# Altium project Raven.PrjPcb
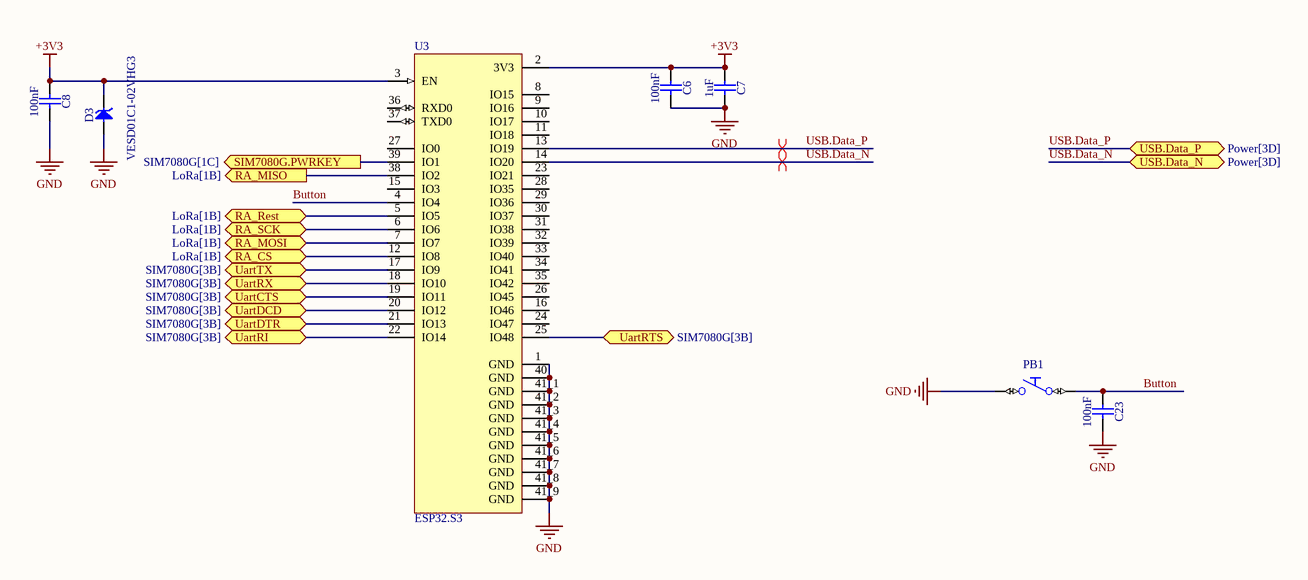
[diagram p0: MCU.SchDoc]
4 sheets, 68 parts. Net scope: flat (ports and power ports of the same name join across sheets).
Board file: PCB1.PcbDoc
Sheets:
  MCU.SchDoc
  Power.SchDoc
  SIM7080G.SchDoc
  LoRa.SchDoc

## Sheet MCU.SchDoc
size A4; SheetNumber: 1; SheetTotal: 4

### Parts
C6  100nF  [CAPC1608X90N]
C7  1uF  [CAPC1608X90N]
C8  100nF  [CAPC1608X90N]
C23  100nF  [CAPC1608X90N]
D3  VESD01C1-02VHG3  [SODFL1608X70N]
PB1  Push Button  [PB_C&K_KSS221GLFS]  (value not drawn)
U3  ESP32.S3  [IC.ESP32.S3.WROOM.1U]

### Ports
RA_CS (bidir, see LoRa[1B]), RA_MISO (out, see LoRa[1B]), RA_MOSI (bidir, see LoRa[1B]), RA_Rest (bidir, see LoRa[1B]), RA_SCK (bidir, see LoRa[1B]), SIM7080G.PWRKEY (out, see SIM7080G[1C]), UartCTS (bidir, see SIM7080G[3B]), UartDCD (bidir, see SIM7080G[3B]), UartDTR (bidir, see SIM7080G[3B]), UartRI (bidir, see SIM7080G[3B]), UartRTS (bidir, see SIM7080G[3B]), UartRX (bidir, see SIM7080G[3B]), UartTX (bidir, see SIM7080G[3B]), USB.Data_N (bidir, see Power[3D]), USB.Data_P (bidir, see Power[3D])

### Nets
+3V3: C6.1 C7.1 C8.1 D3.1(C) U3.2(3V3) U3.3(EN)
GND: C6.2 C7.2 C8.2 C23.2 D3.2(A) PB1.2(NO) U3.1(GND) U3.40(GND) U3.41_1(GND) U3.41_2(GND) U3.41_3(GND) U3.41_4(GND) U3.41_5(GND) U3.41_6(GND) U3.41_7(GND) U3.41_8(GND) U3.41_9(GND)
Button: C23.1 PB1.1(C) U3.4(IO4)
USB.Data_N: U3.14(IO20) ; port USB.Data_N
USB.Data_P: U3.13(IO19) ; port USB.Data_P
NetR22_1: U3.39(IO1) ; port SIM7080G.PWRKEY
NetU3_5: U3.5(IO5) ; port RA_Rest
NetU3_6: U3.6(IO6) ; port RA_SCK
NetU3_7: U3.7(IO7) ; port RA_MOSI
NetU3_12: U3.12(IO8) ; port RA_CS
NetU3_17: U3.17(IO9) ; port UartTX
NetU3_18: U3.18(IO10) ; port UartRX
NetU3_19: U3.19(IO11) ; port UartCTS
NetU3_20: U3.20(IO12) ; port UartDCD
NetU3_21: U3.21(IO13) ; port UartDTR
NetU3_22: U3.22(IO14) ; port UartRI
NetU3_25: U3.25(IO48) ; port UartRTS
NetU3_38: U3.38(IO2) ; port RA_MISO

Not connected (* = marked no-connect by the designer): U3 8(IO15) 9(IO16) 10(IO17) 11(IO18) 15(IO3) 16(IO46) 23(IO21) 24(IO47) 26(IO45) 27(IO0) 28(IO35) 29(IO36) 30(IO37) 31(IO38) 32(IO39) 33(IO40) 34(IO41) 35(IO42) 36(RXD0) 37(TXD0)

### Layout directives
differential pair: USB.Data_N, USB.Data_P

### Library data of the parts
C6 C8 C23 = CC0603_100NF_25V_20%_X5R_TDK_CGA3E2X5R1E104M080: Non-polarised capacitor; Part Description: SMD Multilayer Chip Ceramic Capacitor (Automotive Grade); Manufacturer: TDK; Voltage: 25V; TC: X5R; Tolerance: ±20%; Part Number: CC0603_100NF_25V_20%_X5R_TDK_CGA3E2X5R1E104M080; Component Kind: Standard; Component Type: Standard; Pin Count: 2; Value: 100nF; Status: Not Recommended; Manufacturer Part Number: CGA3E2X5R1E104M080; Case: 0603; Mounted: Yes; Socket: No; SMD: Yes; Sense: No; ComponentHeight: 0.9mm; HelpURL: \\cern.ch\dfs\Applications\Altium\Datasheets\CC0603_X5R_TDK_CGA(Up to 75V).pdf; Author: CERN DEM BC; CreateDate: 7/1/2020; LatestRevisionDate: 7/1/2020
C7 = CC0603_1UF_10V_10%_X5R: Non-polarised capacitor; Part Description: SMD Multilayer Chip Ceramic Capacitor; Manufacturer: GENERIC; Manufacturer1 Part Number: 0603ZD105KAT; Voltage: 10V; TC: X5R; Tolerance: ±10%; Part Number: CC0603_1UF_10V_10%_X5R; Component Kind: Standard; Component Type: Standard; Pin Count: 2; Value: 1uF; Status: None; Manufacturer Part Number: CC0603_1UF_10V_10%_X5R; Case: 0603; Mounted: Yes; Socket: No; SMD: Yes; Sense: No; Manufacturer1 Example: AVX; Manufacturer1 ComponentHeight: 0.9mm; HelpURL: \\cern.ch\dfs\Applications\Altium\Datasheets\CC0603_X5R_AVX_0603ZD105KAT.pdf; Author: CERN DEM HF; CreateDate: 7/10/2023; LatestRevisionDate: 7/10/2023
D3 = VESD01C1-02VHG3: Transient Voltage Suppressor Diode (Uni-Directional); Part Description: Single-Line ESD-Protection (30kV) Diode; Manufacturer: VISHAY SEMICONDUCTORS; Voltage: 1V; Power: 100W; PressFit: No; Bonding: No; Part Number: VESD01C1-02VHG3; Component Kind: Standard; Component Type: Standard; Device: VESD01C1-02VHG3; PackageDescription: SODFL (SOD-523) Diode; 1.20mm W X 0.80mm L X 0.70mm H body, IPC Medium Density; Manufacturer Part Number: VESD01C1-02VHG3; Pin Count: 2; Case: SOD-523; Mounted: Yes; Socket: No; SMD: Yes; Sense: No; ComponentHeight: 0.7mm; HelpURL: \\cern.ch\dfs\Applications\Altium\Datasheets\VESD01C1-02VHG3.pdf; Author: CERN DEM BC; CreateDate: 5/19/2020; LatestRevisionDate: 5/19/2020
PB1 = PB_C&K_KSS221GLFS: Push-Button Switch SPST; Part Description: 32VDC 50mA SPST-NO Surface Mount Subminiature Tact Momentary Side Actuated Pushbutton Switch, Operating Force 2N; Manufacturer: C&K; PressFit: No; Sense Comment: Non-washable; Part Number: PB_C&K_KSS221GLFS; Component Kind: Standard; Component Type: Standard; Pin Count: 2; PackageDescription: Body 7.0x3.5mm, Surface Mount Subminiature Tact Side Actuated Switch, C&K KSS Series; Family: Push Button; Mounted: Yes; Socket: No; SMD: Yes; Sense: Yes; Status: None; Manufacturer Part Number: KSS221GLFS; ComponentHeight: 1.7mm; HelpURL: \\cern.ch\dfs\Applications\Altium\Datasheets\PB_C&K_KSS221GLFS.pdf; Author: CERN DEM BC; CreateDate: 12/2/2019; LatestRevisionDate: 12/2/2019
U3 = IC.ESP32.S3.WROOM.1U: 2.4 GHz Wi-Fi (802.11b/g/n) and Bluetooth® 5 module / Built around ESP32-S3 series of SoCs, Xtensa® dual-core 32-bit LX7 microprocessor / Flash up to 16 MB, PSRAM up to 16 MB / Up to 36 GPIOs, rich set of peripherals / On-board PCB antenna or external antenna connector; ComponentLink1Description: DataSheet; ComponentLink1URL: https://www.espressif.com/sites/default/files/documentation/esp32-s3-wroom-1_wroom-1u_datasheet_en.pdf

## Sheet Power.SchDoc
size A4; SheetNumber: 2; SheetTotal: 4
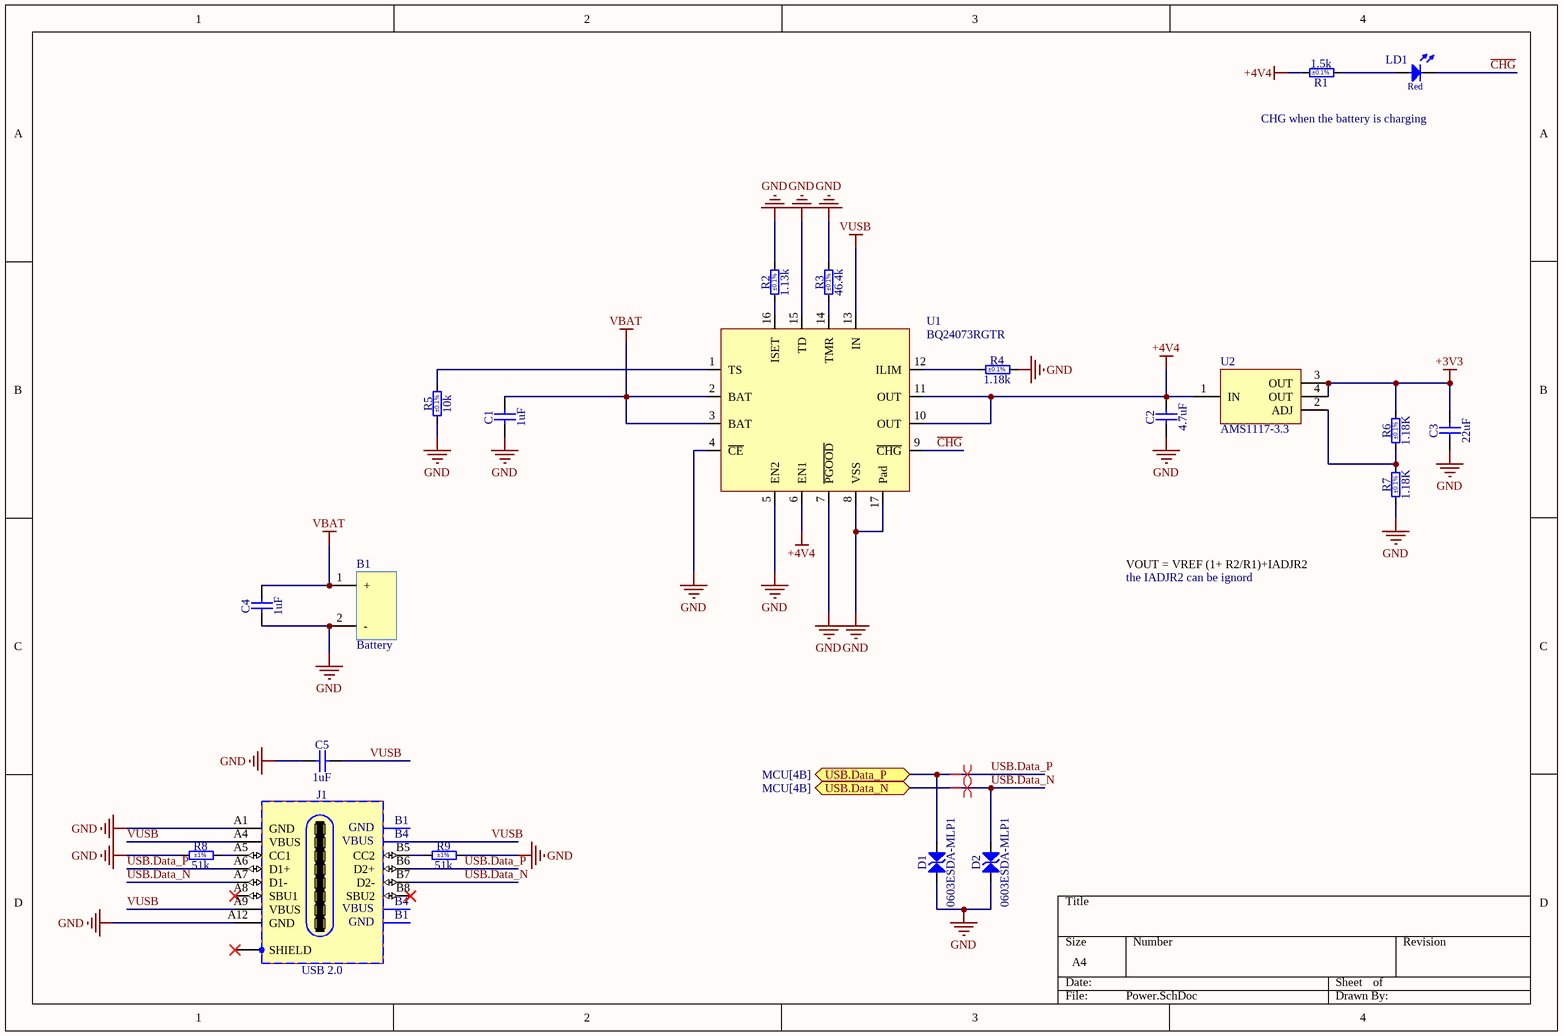
[diagram p1: Power.SchDoc]

### Parts
B1  Battery  [PCB.Battery.Holder.14500]
C1  1uF  [CAPC1608X90N]
C2  4.7uF  [CAPC1608X90N]
C3  22uF  [CAPC1608X90N]
C4  1uF  [CAPC1608X90N]
C5  1uF  [CAPC1608X90N]
D1  0603ESDA-MLP1  [EATON_0603ESDA-MLP]
D2  0603ESDA-MLP1  [EATON_0603ESDA-MLP]
J1  USB 2.0  [GCT_USB4105-GF-A]
LD1  Red  [LED_DIALIGHT_598-8010-107F]
R1  1.5k  Tolerance: ±0.1%  [RESC1608X55N]
R2  1.13k  Tolerance: ±0.1%  [RESC1608X55N]
R3  46.4k  Tolerance: ±0.1%  [RESC1608X55N]
R4  1.18k  Tolerance: ±0.1%  [RESC1608X55N]
R5  10k  Tolerance: ±0.1%  [RESC1608X55N]
R6  1.18K  Tolerance: ±0.1%  [RESC1608X55N]
R7  1.18K  Tolerance: ±0.1%  [RESC1608X55N]
R8  51k  Tolerance: ±1%  [RESC1608X55N]
R9  51k  Tolerance: ±1%  [RESC1608X55N]
U1  BQ24073RGTR  [bq24073]
U2  AMS1117-3.3  [IC.AMS1117-3.3]

### Ports
USB.Data_N (bidir, see MCU[4B]), USB.Data_P (bidir, see MCU[4B])

### Nets
+3V3: C3.2 R6.2 U2.3(OUT) U2.4(OUT)
+4V4: C2.2 R1.2 U1.6(EN1) U1.10(OUT) U1.11(OUT) U2.1(IN)
GND: B1.2(-) C1.1 C2.1 C3.1 C4.1 C5.1 D1.1 D2.1 J1.A1(GND) J1.A12(GND) R2.2 R3.2 R4.2 R5.1 R7.1 R8.1 R9.2 U1.4(~{CE}) U1.5(EN2) U1.7(~{PGOOD}) U1.8(VSS) U1.15(TD) U1.17(Pad)
VBAT: B1.1(+) C1.2 C4.2 U1.2(BAT) U1.3(BAT)
VUSB: C5.2 J1.A4(VBUS) J1.A9(VBUS) U1.13(IN)
~{CHG}: LD1.1(C) U1.9(~{CHG})
USB.Data_N: D2.2 J1.A7(D1-) J1.B7(D2-) ; port USB.Data_N
USB.Data_P: D1.2 J1.A6(D1+) J1.B6(D2+) ; port USB.Data_P
NetJ1_A5: J1.A5(CC1) R8.2
NetJ1_B5: J1.B5(CC2) R9.1
NetLD1_2: LD1.2(A) R1.1
NetR2_1: R2.1 U1.16(ISET)
NetR3_1: R3.1 U1.14(TMR)
NetR4_1: R4.1 U1.12(ILIM)
NetR5_2: R5.2 U1.1(TS)
NetR6_1: R6.1 R7.2 U2.2(ADJ)

Not connected (* = marked no-connect by the designer): J1 A8(SBU1)* B8(SBU2)* SHIELD*

### Layout directives
differential pair: USB.Data_N, USB.Data_P

### Notes on the sheet
- CHG when the battery is charging
- VOUT = VREF (1+ R2/R1)+IADJR2
- the IADJR2 can be ignord
- (in symbol GCT_USB4105-GF-A) B1; B4

### Library data of the parts
B1 = PCB.Battery.Holder.14500: PCB Battery Holder Embeded in PCB
C1 C4 C5 = CC0603_1UF_10V_10%_X5R: as C7 on sheet MCU; Part Number: CC0603_1UF_10V_10%_X5R; Component Kind: Standard; Component Type: Standard; Pin Count: 2; Value: 1uF; Status: None; Manufacturer Part Number: CC0603_1UF_10V_10%_X5R; Case: 0603; Mounted: Yes; Socket: No; SMD: Yes; Sense: No; Manufacturer1 Example: AVX; Manufacturer1 ComponentHeight: 0.9mm; HelpURL: \\cern.ch\dfs\Applications\Altium\Datasheets\CC0603_X5R_AVX_0603ZD105KAT.pdf; Author: CERN DEM HF; CreateDate: 7/10/2023; LatestRevisionDate: 7/10/2023
C2 = CC0603_4.7UF_10V_10%_X5R: Non-polarised capacitor; Part Description: SMD Multilayer Chip Ceramic Capacitor; Manufacturer: GENERIC; Manufacturer1 Part Number: C1608X5R1A475K080; Voltage: 10V; TC: X5R; Tolerance: ±10%; Part Number: CC0603_4.7UF_10V_10%_X5R; Component Kind: Standard; Component Type: Standard; Pin Count: 2; Value: 4.7uF; Status: Preferred; Manufacturer Part Number: CC0603_4.7UF_10V_10%_X5R; Case: 0603; Mounted: Yes; Socket: No; SMD: Yes; Sense: No; Manufacturer1 Example: TDK; Manufacturer1 ComponentHeight: 0.95mm; HelpURL: \\cern.ch\dfs\Applications\Altium\Datasheets\CC0603_X5R_TDK_C_Serie.pdf; Author: CERN DEM HF; CreateDate: 7/10/2023; LatestRevisionDate: 7/10/2023
C3 = CC0603_22UF_10V_20%_X5R: Non-polarised capacitor; Part Description: SMD Multilayer Chip Ceramic Capacitor; Manufacturer: GENERIC; Manufacturer1 Part Number: C1608X5R1A226M080; Voltage: 10V; TC: X5R; Tolerance: ±20%; Part Number: CC0603_22UF_10V_20%_X5R; Component Kind: Standard; Component Type: Standard; Pin Count: 2; Value: 22uF; Status: None; Manufacturer Part Number: CC0603_22UF_10V_20%_X5R; Case: 0603; Mounted: Yes; Socket: No; SMD: Yes; Sense: No; Manufacturer1 Example: TDK; Manufacturer1 ComponentHeight: 0.9mm; HelpURL: \\cern.ch\dfs\Applications\Altium\Datasheets\CC0603_X5R_TDK_C.pdf; Author: CERN DEM BC; CreateDate: 12/3/2020; LatestRevisionDate: 12/3/2020
D1 D2 = 0603ESDA-MLP1: Transient Voltage Suppressor Diode (Bi-Directional); Part Description: 0.05pF 8kV Bidirectional ESD Voltage Suppressor; Manufacturer: EATON; Voltage: 8kV; PressFit: No; Bonding: No; Part Number: 0603ESDA-MLP1; Component Kind: Standard; Component Type: Standard; Device: 0603ESDA-MLP1; PackageDescription: 0603, 2-Leads, Body 1.1mm L X 0.53mm W X 0.44mm H body, IPC Medium Density; Manufacturer Part Number: 0603ESDA-MLP1; Pin Count: 2; Case: 0603; Mounted: Yes; Socket: No; SMD: Yes; Sense: No; ComponentHeight: 0.38mm; HelpURL: \\cern.ch\dfs\Applications\Altium\Datasheets\0603ESDA-MLP1.pdf; Author: CERN DEM HF; CreateDate: 9/21/2022; LatestRevisionDate: 9/21/2022
J1 = GCT_USB4105-GF-A: 2x8 Pin + 1 Shield  USB Type C Receptacle; Part Description: USB 2.0 Type C Receptacle 16 Contacts, SMD, horizontal; Manufacturer: GCT; PressFit: No; Part Number: GCT_USB4105-GF-A; Component Kind: Standard; Component Type: Standard; Pin Count: 20; Family: USB 2.0; Mounted: Yes; Socket: No; SMD: Yes; Sense: No; Status: None; Manufacturer Part Number: USB4105-GF-A; ComponentHeight: 3.31mm; HelpURL: \\cern.ch\dfs\Applications\Altium\Datasheets\GCT_USB4105-GF-A.pdf; Author: CERN DEM HF; CreateDate: 10/12/2023; LatestRevisionDate: 10/12/2023
LD1 = LED_DIALIGHT_598-8010-107F: LED Red 1C 2A; Part Description: Micro SMD Red Led, 598 Series; PressFit: No; Bonding: No; Part Number: LED_DIALIGHT_598-8010-107F; Component Kind: Standard; Component Type: Standard; Color: Red; PackageDescription: SMT Red LED, Body 1.6x0.8mm, 0603 Case,  DIALIGHT 598 Series; Manufacturer: DIALIGHT; Manufacturer Part Number: 598-8010-107F; Pin Count: 2; Case: 0603; Mounted: Yes; Socket: No; SMD: Yes; Sense: No; ComponentHeight: 0.7mm; HelpURL: \\cern.ch\dfs\Applications\Altium\Datasheets\LED_DIALIGHT_598-8010-107F.pdf; Author: CERN DEM MR; CreateDate: 1/9/2017; LatestRevisionDate: 1/9/2017
R1-R5 = R0603_10K_0.1%_0.063W_10PPM: Resistor - 0.1%; Part Description: Thin Film Chip Resistor; Manufacturer: GENERIC; Manufacturer1 Part Number: RN73C1J10KBTDF; Power: 0.063W; TC: ±10ppm; PressFit: No; Part Number: R0603_10K_0.1%_0.063W_10PPM; Component Kind: Standard; Component Type: Standard; Pin Count: 2; Status: Not Recommended; Manufacturer Part Number: R0603_10K_0.1%_0.063W_10PPM; Case: 0603; Mounted: Yes; Sense: No; Socket: No; SMD: Yes; Manufacturer1 Example: TYCO HOLSWORTHY; Manufacturer1 ComponentHeight: 0.5mm; HelpURL: \\cern.ch\dfs\Applications\Altium\Datasheets\R0603_Tyco_RN73.pdf; Author: CERN DEM JLC; CreateDate: 12/3/2007; LatestRevisionDate: 3/13/2008
  R1: Value: 1.5k
  R2: Value: 1.13k
  R3: Value: 46.4k
  R4: Value: 1.18k
  R5: Value: 10k
R6 R7 = R0603_118R_0.1%_0.063W_10PPM: Resistor - 0.1%; Part Description: Thin Film Chip Resistor; Manufacturer: GENERIC; Manufacturer1 Part Number: RN73C1J118RBTDF; Power: 0.063W; TC: ±10ppm; PressFit: No; Part Number: R0603_118R_0.1%_0.063W_10PPM; Component Kind: Standard; Component Type: Standard; Pin Count: 2; Value: 1.18K; Status: Not Recommended; Manufacturer Part Number: R0603_118R_0.1%_0.063W_10PPM; Case: 0603; Mounted: Yes; Sense: No; Socket: No; SMD: Yes; Manufacturer1 Example: TYCO HOLSWORTHY; Manufacturer1 ComponentHeight: 0.5mm; HelpURL: \\cern.ch\dfs\Applications\Altium\Datasheets\R0603_Tyco_RN73.pdf; Author: CERN DEM JLC; CreateDate: 12/3/2007; LatestRevisionDate: 3/13/2008
R8 R9 = R0603_51K_1%_0.1W_100PPM: Resistor - 1%; Part Description: General Purpose Thick Film Chip Resistor; Manufacturer: GENERIC; Manufacturer1 Part Number: NRC06F5102TRF; Power: 0.1W; TC: ±100ppm/°C; PressFit: No; Part Number: R0603_51K_1%_0.1W_100PPM; Component Kind: Standard; Component Type: Standard; Pin Count: 2; Value: 51k; Status: Preferred; Manufacturer Part Number: R0603_51K_1%_0.1W_100PPM; Case: 0603; Mounted: Yes; Sense: No; Socket: No; SMD: Yes; Manufacturer1 Example: NIC COMPONENT; Manufacturer1 ComponentHeight: 0.55mm; HelpURL: \\cern.ch\dfs\Applications\Altium\Datasheets\R0603_NIC_NRC.pdf; Author: CERN DEM JLC; CreateDate: 12/3/2007; LatestRevisionDate: 3/13/2008
U1 = BQ24073RGTR: 1.5A USB-FRIENDLY Li-Ion BATTERY CHARGER AND POWER-PATH MANAGEMENT IC
U2 = IC.AMS1117-3.3: 72dB@(120Hz) 1A Fixed 3.3V Positive electrode SOT-223-3 Linear Voltage Regulators (LDO) ROHS

## Sheet SIM7080G.SchDoc
size A3; SheetNumber: 3; SheetTotal: 4
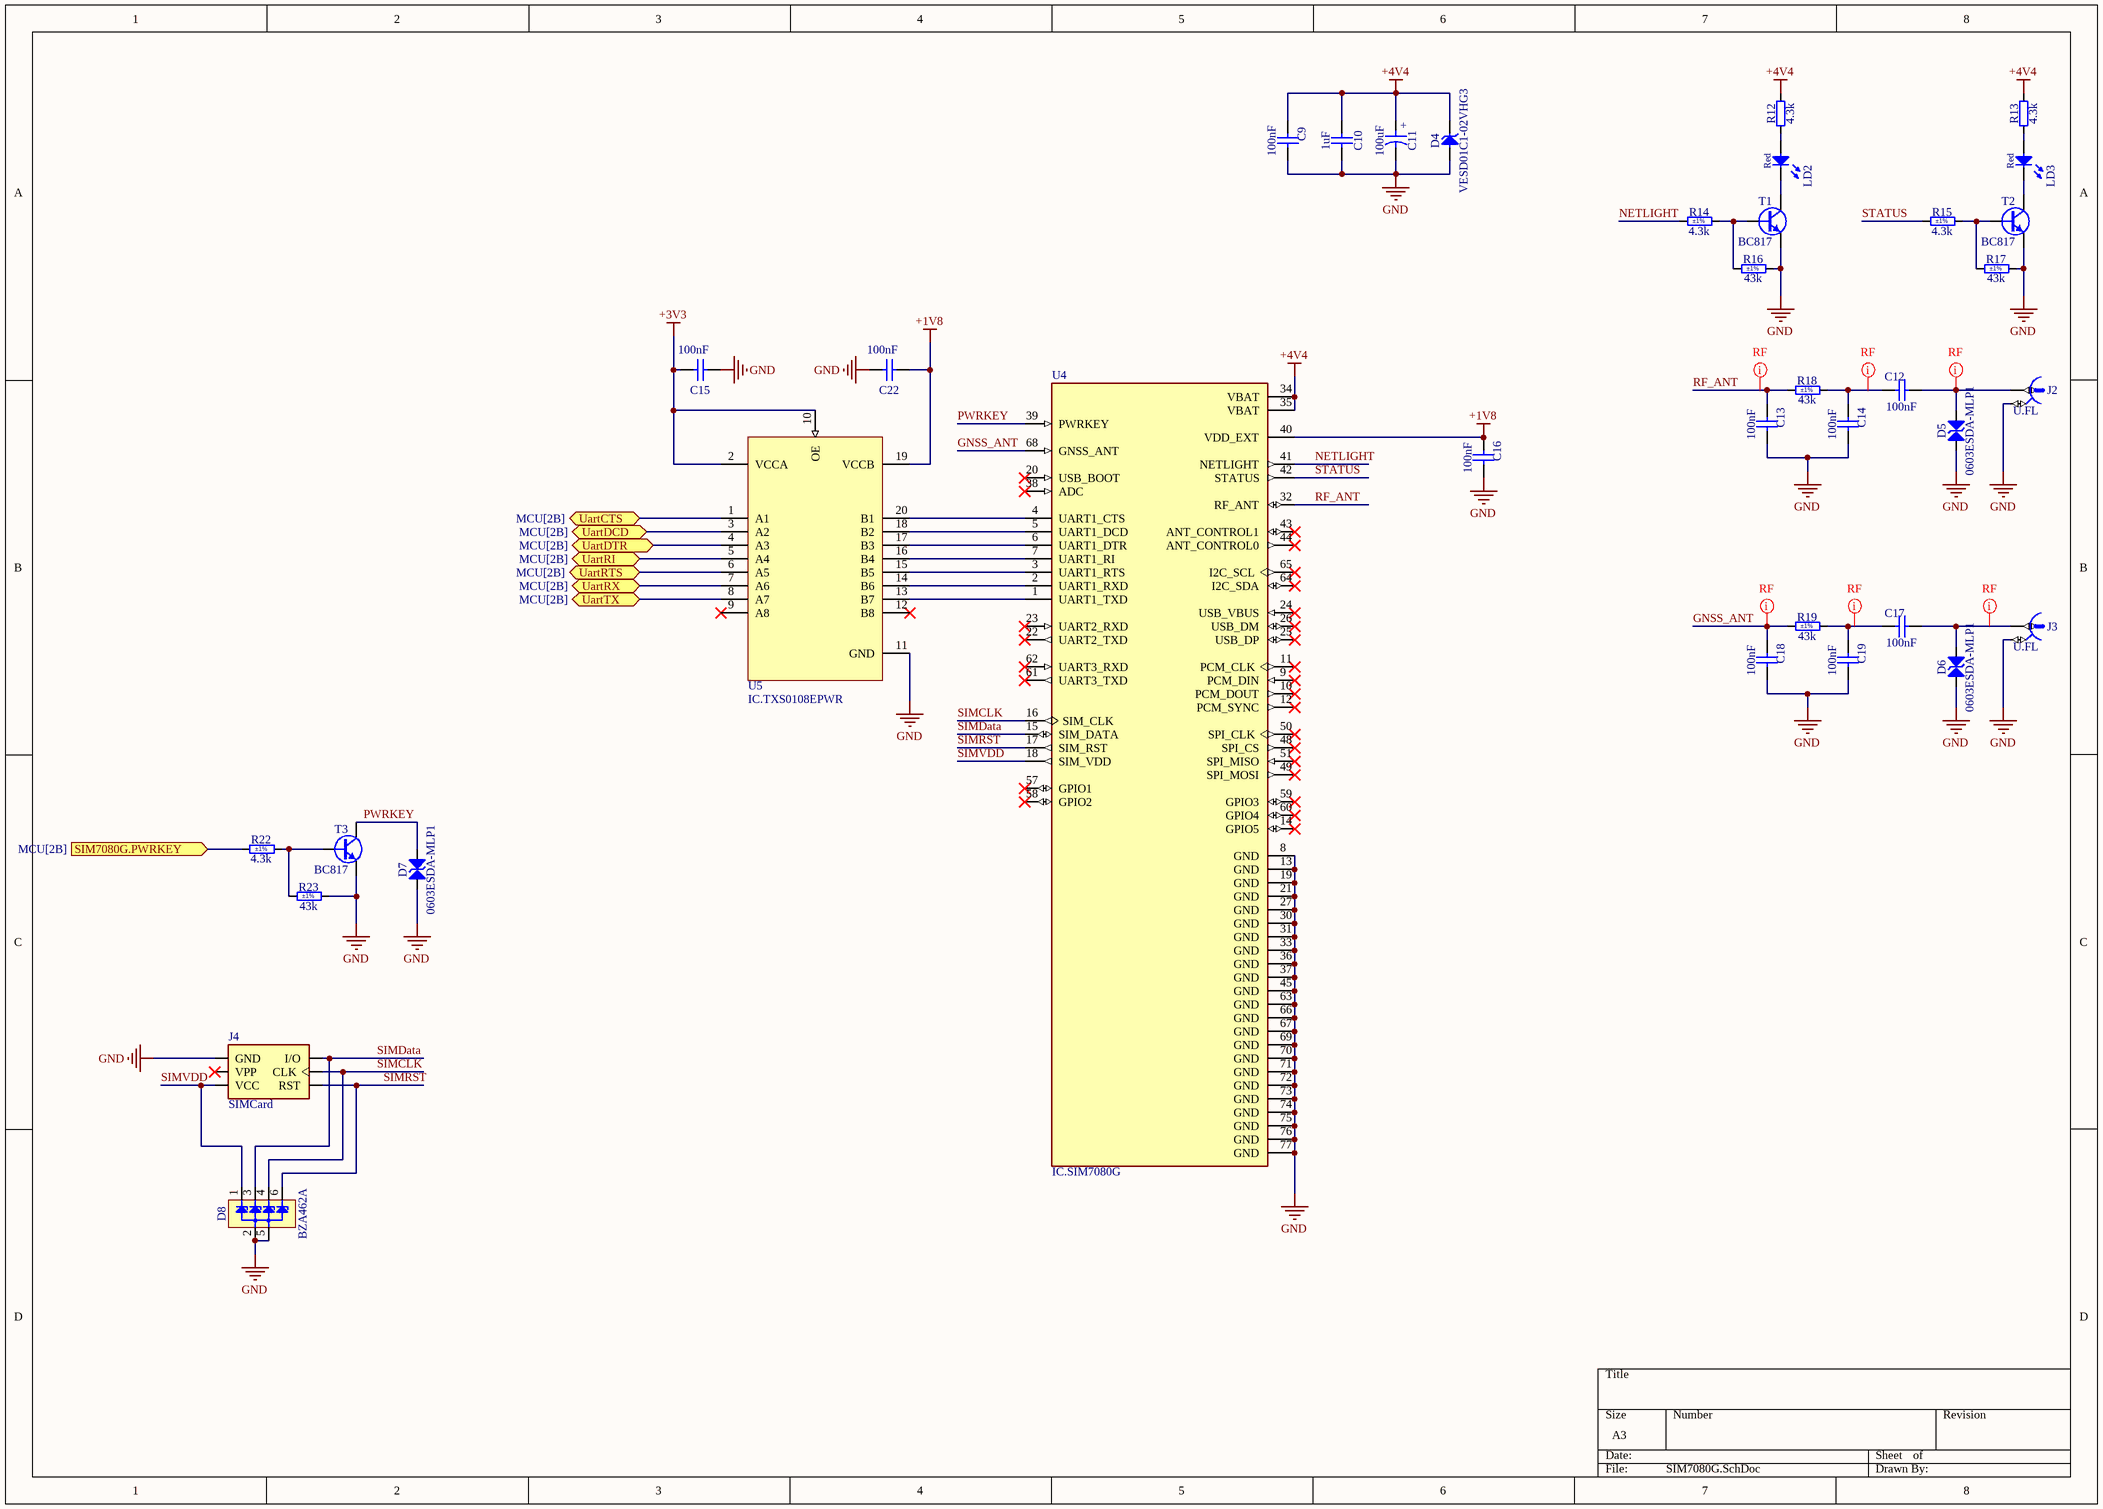
[diagram p2: SIM7080G.SchDoc]

### Parts
C9  100nF  [CAPC1608X90N]
C10  1uF  [CAPC1608X90N]
C11  100uF  [CAPAE660X540N]
C12  100nF  [CAPC1608X90N]
C13  100nF  [CAPC1608X90N]
C14  100nF  [CAPC1608X90N]
C15  100nF  [CAPC1608X90N]
C16  100nF  [CAPC1608X90N]
C17  100nF  [CAPC1608X90N]
C18  100nF  [CAPC1608X90N]
C19  100nF  [CAPC1608X90N]
C22  100nF  [CAPC1608X90N]
D4  VESD01C1-02VHG3  [SODFL1608X70N]
D5  0603ESDA-MLP1  [EATON_0603ESDA-MLP]
D6  0603ESDA-MLP1  [EATON_0603ESDA-MLP]
D7  0603ESDA-MLP1  [EATON_0603ESDA-MLP]
D8  BZA462A  [SOT95P275X110-6N]
J2  U.FL  [HIROSE_U.FL-R-SMT-1(10)]
J3  U.FL  [HIROSE_U.FL-R-SMT-1(10)]
J4  SIMCard  [Connector.SIM805]
LD2  Red  [LED_DIALIGHT_598-8010-107F]
LD3  Red  [LED_DIALIGHT_598-8010-107F]
R12  4.3k  [RESC1608X55N]
R13  4.3k  [RESC1608X55N]
R14  4.3k  Tolerance: ±1%  [RESC1608X55N]
R15  4.3k  Tolerance: ±1%  [RESC1608X55N]
R16  43k  Tolerance: ±1%  [RESC1608X55N]
R17  43k  Tolerance: ±1%  [RESC1608X55N]
R18  43k  Tolerance: ±1%  [RESC1608X55N]
R19  43k  Tolerance: ±1%  [RESC1608X55N]
R22  4.3k  Tolerance: ±1%  [RESC1608X55N]
R23  43k  Tolerance: ±1%  [RESC1608X55N]
T1  BC817  [SOT95P230X110-3N]
T2  BC817  [SOT95P230X110-3N]
T3  BC817  [SOT95P230X110-3N]
U4  IC.SIM7080G  [IC.SIM7080G]
U5  IC.TXS0108EPWR  [IC.TXS0108EPWR]

### Ports
SIM7080G.PWRKEY (in, see MCU[2B]), UartCTS (bidir, see MCU[2B]), UartDCD (bidir, see MCU[2B]), UartDTR (bidir, see MCU[2B]), UartRI (bidir, see MCU[2B]), UartRTS (bidir, see MCU[2B]), UartRX (bidir, see MCU[2B]), UartTX (bidir, see MCU[2B])

### Nets
+1V8: C16.1 C22.2 U4.40(VDD_EXT) U5.19(VCCB)
+3V3: C15.1 U5.2(VCCA) U5.10(OE)
+4V4: C9.1 C10.1 C11.1 D4.1(C) R12.2 R13.2 U4.34(VBAT) U4.35(VBAT)
GND: C9.2 C10.2 C11.2 C13.2 C14.2 C15.2 C16.2 C18.2 C19.2 C22.1 D4.2(A) D5.1 D6.1 D7.1 D8.2(A) D8.5(A) J2.2 J3.2 J4.C5(GND) R16.2 R17.2 R23.2 T1.2(E) T2.2(E) T3.2(E) U4.8(GND) U4.13(GND) U4.19(GND) U4.21(GND) U4.27(GND) U4.30(GND) U4.31(GND) U4.33(GND) U4.36(GND) U4.37(GND) U4.45(GND) U4.63(GND) U4.66(GND) U4.67(GND) U4.69(GND) U4.70(GND) U4.71(GND) U4.72(GND) U4.73(GND) U4.74(GND) U4.75(GND) U4.76(GND) U4.77(GND) U5.11(GND)
GNSS_ANT: C18.1 R19.1 U4.68(GNSS_ANT)
NETLIGHT: R14.1 U4.41(NETLIGHT)
PWRKEY: D7.2 T3.3(C) U4.39(PWRKEY)
RF_ANT: C13.1 R18.1 U4.32(RF_ANT)
SIMCLK: D8.4(C3) J4.C3(CLK) U4.16(SIM_CLK)
SIMData: D8.3(C2) J4.C7(I/O) U4.15(SIM_DATA)
SIMRST: D8.6(C4) J4.C2(RST) U4.17(SIM_RST)
SIMVDD: D8.1(C1) J4.C1(VCC) U4.18(SIM_VDD)
STATUS: R15.1 U4.42(STATUS)
NetC12_1: C12.1 C14.1 R18.2
NetC12_2: C12.2 D5.2 J2.1
NetC17_1: C17.1 C19.1 R19.2
NetC17_2: C17.2 D6.2 J3.1
NetLD2_1: LD2.1(C) T1.3(C)
NetLD2_2: LD2.2(A) R12.1
NetLD3_1: LD3.1(C) T2.3(C)
NetLD3_2: LD3.2(A) R13.1
NetR14_2: R14.2 R16.1 T1.1(B)
NetR15_2: R15.2 R17.1 T2.1(B)
NetR22_1: R22.1 ; port SIM7080G.PWRKEY
NetR22_2: R22.2 R23.1 T3.1(B)
NetU3_17: U5.8(A7) ; port UartTX
NetU3_18: U5.7(A6) ; port UartRX
NetU3_19: U5.1(A1) ; port UartCTS
NetU3_20: U5.3(A2) ; port UartDCD
NetU3_21: U5.4(A3) ; port UartDTR
NetU3_22: U5.5(A4) ; port UartRI
NetU3_25: U5.6(A5) ; port UartRTS
NetU4_1: U4.1(UART1_TXD) U5.13(B7)
NetU4_2: U4.2(UART1_RXD) U5.14(B6)
NetU4_3: U4.3(UART1_RTS) U5.15(B5)
NetU4_4: U4.4(UART1_CTS) U5.20(B1)
NetU4_5: U4.5(UART1_DCD) U5.18(B2)
NetU4_6: U4.6(UART1_DTR) U5.17(B3)
NetU4_7: U4.7(UART1_RI) U5.16(B4)

Not connected (* = marked no-connect by the designer): J4 C6(VPP)*; U4 9(PCM_DIN)* 10(PCM_DOUT)* 11(PCM_CLK)* 12(PCM_SYNC)* 14(GPIO5)* 20(USB_BOOT)* 22(UART2_TXD)* 23(UART2_RXD)* 24(USB_VBUS)* 25(USB_DP)* 26(USB_DM)* 38(ADC)* 43(ANT_CONTROL1)* 44(ANT_CONTROL0)* 48(SPI_CS)* 49(SPI_MOSI)* 50(SPI_CLK)* 51(SPI_MISO)* 57(GPIO1)* 58(GPIO2)* 59(GPIO3)* 60(GPIO4)* 61(UART3_TXD)* 62(UART3_RXD)* 64(I2C_SDA)* 65(I2C_SCL)*; U5 9(A8)* 12(B8)*

### Layout directives
net class RF: GNSS_ANT, NetC12_1, NetC12_2, NetC17_1, NetC17_2, RF_ANT

### Notes on the sheet
- (in symbol CAE660-540_100UF_6.3V_20%) +

### Library data of the parts
C9 C12-C19 C22 = CC0603_100NF_25V_20%_X5R_TDK_CGA3E2X5R1E104M080: as C6 on sheet MCU; Part Number: CC0603_100NF_25V_20%_X5R_TDK_CGA3E2X5R1E104M080; Component Kind: Standard; Component Type: Standard; Pin Count: 2; Value: 100nF; Status: Not Recommended; Manufacturer Part Number: CGA3E2X5R1E104M080; Case: 0603; Mounted: Yes; Socket: No; SMD: Yes; Sense: No; ComponentHeight: 0.9mm; HelpURL: \\cern.ch\dfs\Applications\Altium\Datasheets\CC0603_X5R_TDK_CGA(Up to 75V).pdf; Author: CERN DEM BC; CreateDate: 7/1/2020; LatestRevisionDate: 7/1/2020
C10 = CC0603_1UF_10V_10%_X5R: as C7 on sheet MCU; Part Number: CC0603_1UF_10V_10%_X5R; Component Kind: Standard; Component Type: Standard; Pin Count: 2; Value: 1uF; Status: None; Manufacturer Part Number: CC0603_1UF_10V_10%_X5R; Case: 0603; Mounted: Yes; Socket: No; SMD: Yes; Sense: No; Manufacturer1 Example: AVX; Manufacturer1 ComponentHeight: 0.9mm; HelpURL: \\cern.ch\dfs\Applications\Altium\Datasheets\CC0603_X5R_AVX_0603ZD105KAT.pdf; Author: CERN DEM HF; CreateDate: 7/10/2023; LatestRevisionDate: 7/10/2023
C11 = CAE660-540_100UF_6.3V_20%: Polarised capacitor; Part Description: Aluminum Electrolytic SMT Capacitor; Manufacturer: PANASONIC; Manufacturer Part Number: EEEFK0J101AP; Voltage: 6.3V; Tolerance: ±20%; Part Number: CAE660-540_100UF_6.3V_20%; Component Kind: Standard; Component Type: Standard; Pin Count: 2; Value: 100uF; Status: Not Recommended; Case: D; Mounted: Yes; Socket: No; SMD: Yes; Sense: No; ComponentHeight: 5.8mm; HelpURL: \\cern.ch\dfs\Applications\Altium\Datasheets\CAE_PANASONIC_FK-V.pdf; Author: CERN DEM JLC; CreateDate: 12/3/2007; LatestRevisionDate: 11/5/2014
D4 = VESD01C1-02VHG3: as D3 on sheet MCU; Part Number: VESD01C1-02VHG3; Component Kind: Standard; Component Type: Standard; Device: VESD01C1-02VHG3; PackageDescription: SODFL (SOD-523) Diode; 1.20mm W X 0.80mm L X 0.70mm H body, IPC Medium Density; Manufacturer Part Number: VESD01C1-02VHG3; Pin Count: 2; Case: SOD-523; Mounted: Yes; Socket: No; SMD: Yes; Sense: No; ComponentHeight: 0.7mm; HelpURL: \\cern.ch\dfs\Applications\Altium\Datasheets\VESD01C1-02VHG3.pdf; Author: CERN DEM BC; CreateDate: 5/19/2020; LatestRevisionDate: 5/19/2020
D5-D7 = 0603ESDA-MLP1: as D1 on sheet Power; Part Number: 0603ESDA-MLP1; Component Kind: Standard; Component Type: Standard; Device: 0603ESDA-MLP1; PackageDescription: 0603, 2-Leads, Body 1.1mm L X 0.53mm W X 0.44mm H body, IPC Medium Density; Manufacturer Part Number: 0603ESDA-MLP1; Pin Count: 2; Case: 0603; Mounted: Yes; Socket: No; SMD: Yes; Sense: No; ComponentHeight: 0.38mm; HelpURL: \\cern.ch\dfs\Applications\Altium\Datasheets\0603ESDA-MLP1.pdf; Author: CERN DEM HF; CreateDate: 9/21/2022; LatestRevisionDate: 9/21/2022
D8 = BZA462A: Quadruple ESD Transient Voltage Suppressor; Manufacturer: NXP SEMICONDUCTORS; Voltage: 15kV; Power: 24W; PressFit: No; Bonding: No; Part Number: BZA462A; Component Kind: Standard; Component Type: Standard; Device: BZA462A; PackageDescription: SOT, 0.95mm Pitch; 6 Pin, 1.50mm W X 2.90mm L X 1.10mm H body, IPC Medium Density; Part Description: Quadruple ESD Transient Voltage Suppressor; Manufacturer Part Number: BZA462A; Pin Count: 6; Case: SOT23-6; Mounted: Yes; Socket: No; SMD: Yes; Sense: No; ComponentHeight: 1.1mm; HelpURL: \\cern.ch\dfs\Applications\Altium\Datasheets\BZA462A.pdf; Author: CERN DEM JLC; CreateDate: 11/9/2016; LatestRevisionDate: 11/9/2016
J2 J3 = HIROSE_U.FL-R-SMT-1(10): Part Description: Up to 6GHz Ultra Small Surface Mount Male Coaxial Connectors U.FL Series; Manufacturer: HIROSE (HRS); PressFit: No; Part Number: HIROSE_U.FL-R-SMT-1(10); Component Kind: Standard; Component Type: Standard; Pin Count: 2; Family: U.FL; Mounted: Yes; Socket: No; SMD: Yes; Sense: No; Status: None; Manufacturer Part Number: U.FL-R-SMT-1(10); ComponentHeight: 1.25mm; HelpURL: \\cern.ch\dfs\Applications\Altium\Datasheets\HIROSE_U.FL-R-SMT-1(10).pdf; Author: CERN DEM JLC; CreateDate: 3/24/2010; LatestRevisionDate: 3/24/2010
J4 = Connector.SIM8051: SIM Nano Push Pull 6P1.35mmH with Logo 3µ" Gold No Peg; Manufacturer: Global Connector Technology; Manufacturer Part Number: SIM8051-6-0-14-00-A; MP: SIM8051-6-0-14-00-X-REVD; Price: None; Value: *; Package: None; Availability: Unavailable; Supplier 1: Future Electronics; RoHS: Yes; Category: Connectors; Pricing 1: 1500=0.52, 3000=0.51, 4500=0.5 (USD); ComponentLink1URL: https://datasheet.octopart.com/SIM8051-6-0-14-00-A-Global-Connector-Technology-datasheet-78375543.pdf?src-supplier=Future+Electronics; ComponentLink1Description: https://datasheet.octopart.com/SIM8051-6-0-14-00-A-Global-Connector-Technology-datasheet-78375543.pdf?src-supplier=Future+Electronics; ComponentLink2URL: https://gct.co/files/drawings/sim8051.pdf?src-supplier=Digikey; ComponentLink2Description: https://gct.co/files/drawings/sim8051.pdf?src-supplier=Digikey; ComponentLink3URL: https://datasheet.octopart.com/SIM8051-6-0-14-00-A-Global-Connector-Technology-datasheet-91940710.pdf?src-supplier=Newark; ComponentLink3Description: https://datasheet.octopart.com/SIM8051-6-0-14-00-A-Global-Connector-Technology-datasheet-91940710.pdf?src-supplier=Newark; ComponentLink4Description: Shop; ComponentLink4URL: https://eshop.eca.ir/%D8%B3%D9%88%DA%A9%D8%AA-%D8%AD%D8%A7%D9%81%D8%B8%D9%87-%D9%88-%D8%B3%DB%8C%D9%85-%DA%A9%D8%A7%D8%B1%D8%AA/10211-%D8%B3%D9%88%DA%A9%D8%AA-%D8%B3%DB%8C%D9%85-%DA%A9%D8%A7%D8%B1%D8%AA-%D9%86%D8%A7%D9%86%D9%88-6pin-%D9%BE%D9%84%D8%A7%D8%B3%D8%AA%DB%8C%DA%A9%DB%8C-%D8%A8%D8%A7-%D9%87%D9%88%D9%84%D8%AF%D8%B1-%D9%81%D9%84%D8%B2%DB%8C.html
LD2 LD3 = LED_DIALIGHT_598-8010-107F: as LD1 on sheet Power; Part Number: LED_DIALIGHT_598-8010-107F; Component Kind: Standard; Component Type: Standard; Color: Red; PackageDescription: SMT Red LED, Body 1.6x0.8mm, 0603 Case,  DIALIGHT 598 Series; Manufacturer: DIALIGHT; Manufacturer Part Number: 598-8010-107F; Pin Count: 2; Case: 0603; Mounted: Yes; Socket: No; SMD: Yes; Sense: No; ComponentHeight: 0.7mm; HelpURL: \\cern.ch\dfs\Applications\Altium\Datasheets\LED_DIALIGHT_598-8010-107F.pdf; Author: CERN DEM MR; CreateDate: 1/9/2017; LatestRevisionDate: 1/9/2017
R12-R19 R22 R23 = R0603_43K_1%_0.1W_100PPM: Resistor - 1%; Part Description: General Purpose Thick Film Chip Resistor; Manufacturer: GENERIC; Manufacturer1 Part Number: NRC06F4302TRF; Power: 0.1W; TC: ±100ppm/°C; PressFit: No; Part Number: R0603_43K_1%_0.1W_100PPM; Component Kind: Standard; Component Type: Standard; Pin Count: 2; Status: Preferred; Manufacturer Part Number: R0603_43K_1%_0.1W_100PPM; Case: 0603; Mounted: Yes; Sense: No; Socket: No; SMD: Yes; Manufacturer1 Example: NIC COMPONENT; Manufacturer1 ComponentHeight: 0.55mm; HelpURL: \\cern.ch\dfs\Applications\Altium\Datasheets\R0603_NIC_NRC.pdf; Author: CERN DEM JLC; CreateDate: 12/3/2007; LatestRevisionDate: 3/13/2008
  R12-R15 R22: Value: 4.3k
  R16-R19 R23: Value: 43k
T1-T3 = BC817: NPN Transistor; Part Description: 45V 500mA NPN General-Purpose Transistor; Manufacturer: NXP SEMICONDUCTORS; PressFit: No; Bonding: No; Part Number: BC817; Component Kind: Standard; Component Type: Standard; Device: BC817; PackageDescription: SOT23, 0.95mm Pitch; 3 Pin, 1.30mm W X 2.90mm L X 1.10mm H body, IPC Medium Density; Manufacturer Part Number: BC817; Pin Count: 3; Case: SOT23-3; Mounted: Yes; Socket: No; SMD: Yes; Sense: No; ComponentHeight: 1.1mm; HelpURL: \\cern.ch\dfs\Applications\Altium\Datasheets\BC817.pdf; Author: CERN DEM JLC; CreateDate: 5/12/2011; LatestRevisionDate: 5/12/2011
U4 = IC.SIM7080G: Cellular, Navigation Galileo, GLONASS, GPS, GNSS, LTE Transceiver Module 1.559GHz ~ 1.576GHz, 1.575GHz ~ 1.576GHz, 1.574GHz ~ 1.606GHz, 1.598GHz ~ 1.563GHz Antenna Not Included Surface Mount; MF: SIMCom; SnapEDA_Link: https://www.snapeda.com/parts/SIM7080G/SIMCom/view-part/?ref=snap; Package: Package; MP: SIM7080G; Check_prices: https://www.snapeda.com/parts/SIM7080G/SIMCom/view-part/?ref=eda
U5 = IC.TXS0108EPWR: 8-bit bidirectional voltage-level shifter for open-drain and push-pull application; MF: Texas Instruments; Value: *; SnapEDA_Link: https://www.snapeda.com/parts/TXS0108EPWR/Texas+Instruments/view-part/?ref=snap; Purchase-URL: https://pricing.snapeda.com/search/part/TXS0108EPWR/?ref=eda; Availability: In Stock; Price: None; Package: TSSOP-20 Texas Instruments; Check_prices: https://www.snapeda.com/parts/TXS0108EPWR/Texas+Instruments/view-part/?ref=eda; MP: TXS0108EPWR

## Sheet LoRa.SchDoc
size A; SheetNumber: 4; SheetTotal: 4
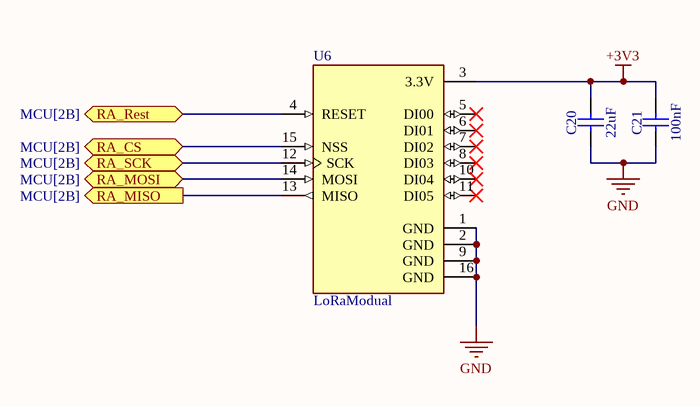
[diagram p3: LoRa.SchDoc]

### Parts
C20  22uF  [CAPC1608X90N]
C21  100nF  [CAPC1608X90N]
U6  LoRaModual  [IC.RA-02]

### Ports
RA_CS (bidir, see MCU[2B]), RA_MISO (out, see MCU[2B]), RA_MOSI (bidir, see MCU[2B]), RA_Rest (bidir, see MCU[2B]), RA_SCK (bidir, see MCU[2B])

### Nets
+3V3: C20.2 C21.2 U6.3(3.3V)
GND: C20.1 C21.1 U6.1(GND) U6.2(GND) U6.9(GND) U6.16(GND)
NetU3_5: U6.4(RESET) ; port RA_Rest
NetU3_6: U6.12(SCK) ; port RA_SCK
NetU3_7: U6.14(MOSI) ; port RA_MOSI
NetU3_12: U6.15(NSS) ; port RA_CS
NetU3_38: U6.13(MISO) ; port RA_MISO

Not connected (* = marked no-connect by the designer): U6 5(DI00)* 6(DI01)* 7(DI02)* 8(DI03)* 10(DI04)* 11(DI05)*

### Library data of the parts
C20 = CC0603_22UF_6.3V_20%_X5R: Non-polarised capacitor; Part Description: SMD Multilayer Chip Ceramic Capacitor; Manufacturer: GENERIC; Manufacturer1 Part Number: C1608X5R0J226M080; Voltage: 6.3V; TC: X5R; Tolerance: ±20%; Part Number: CC0603_22UF_6.3V_20%_X5R; Component Kind: Standard; Component Type: Standard; Pin Count: 2; Value: 22uF; Status: None; Manufacturer Part Number: CC0603_22UF_6.3V_20%_X5R; Case: 0603; Mounted: Yes; Socket: No; SMD: Yes; Sense: No; Manufacturer1 Example: TDK; Manufacturer1 ComponentHeight: 0.9mm; HelpURL: \\cern.ch\dfs\Applications\Altium\Datasheets\CC0603_X5R_TDK_C.pdf; Author: CERN DEM JLC; CreateDate: 12/16/2013; LatestRevisionDate: 12/3/2020
C21 = CC0603_100NF_100V_10%_X7R: Non-polarised capacitor; Part Description: SMD Multilayer Chip Ceramic Capacitor; Manufacturer: GENERIC; Manufacturer1 Part Number: GRM188R72A104KA35D; Voltage: 100V; TC: X7R; Tolerance: ±10%; Part Number: CC0603_100NF_100V_10%_X7R; Component Kind: Standard; Component Type: Standard; Pin Count: 2; Value: 100nF; Status: None; Manufacturer Part Number: CC0603_100NF_100V_10%_X7R; Case: 0603; Mounted: Yes; Socket: No; SMD: Yes; Sense: No; Manufacturer1 Example: MURATA; Manufacturer1 ComponentHeight: 0.9mm; HelpURL: \\cern.ch\dfs\Applications\Altium\Datasheets\CC0603_MURATA_GRM188R72A104KA35D.pdf; Author: CERN DEM JLC; CreateDate: 12/11/2013; LatestRevisionDate: 12/11/2013
U6 = IC.RA-02: General ISM < 1GHz LoRaâ„¢ Transceiver Module 410MHz ~ 525MHz Antenna Not Included, I-PEX Surface Mount; MF: Ai-Thinker; MP: RA-02; SnapEDA_Link: https://www.snapeda.com/parts/RA-02/AI-Thinker/view-part/?ref=snap; Package: None; Value: *; Check_prices: https://www.snapeda.com/parts/RA-02/AI-Thinker/view-part/?ref=eda

## Nets that join several sheets
+3V3: MCU (6 pins), Power (C3.2 R6.2 U2.3 U2.4), SIM7080G (C15.1 U5.2 U5.10), LoRa (C20.2 C21.2 U6.3)
+4V4: Power (6 pins), SIM7080G (8 pins)
GND: MCU (17 pins), Power (23 pins), SIM7080G (49 pins), LoRa (6 pins)
NetR22_1: MCU (U3.39), SIM7080G (R22.1)
NetU3_5: MCU (U3.5), LoRa (U6.4)
NetU3_6: MCU (U3.6), LoRa (U6.12)
NetU3_7: MCU (U3.7), LoRa (U6.14)
NetU3_12: MCU (U3.12), LoRa (U6.15)
NetU3_17: MCU (U3.17), SIM7080G (U5.8)
NetU3_18: MCU (U3.18), SIM7080G (U5.7)
NetU3_19: MCU (U3.19), SIM7080G (U5.1)
NetU3_20: MCU (U3.20), SIM7080G (U5.3)
NetU3_21: MCU (U3.21), SIM7080G (U5.4)
NetU3_22: MCU (U3.22), SIM7080G (U5.5)
NetU3_25: MCU (U3.25), SIM7080G (U5.6)
NetU3_38: MCU (U3.38), LoRa (U6.13)
USB.Data_N: MCU (U3.14), Power (D2.2 J1.A7 J1.B7)
USB.Data_P: MCU (U3.13), Power (D1.2 J1.A6 J1.B6)